# EAGLE design mic (EAGLE 6.5.0)
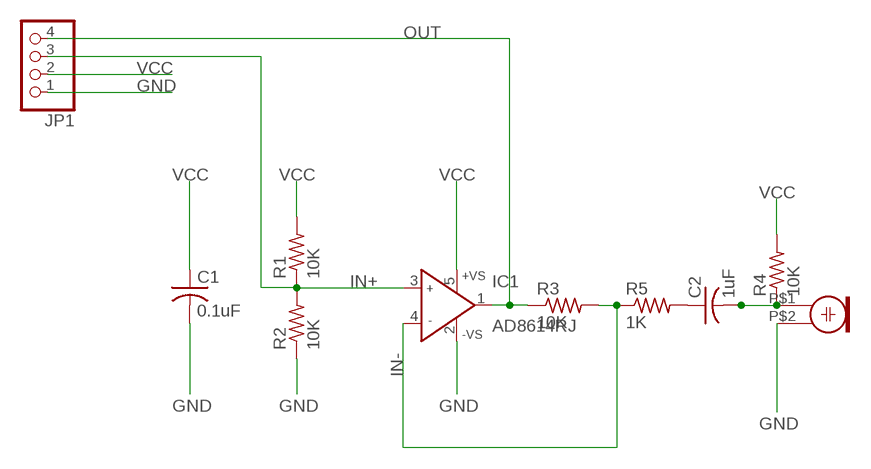
[diagram p0: schematic, sheet 1]

## Parts
C1  0.1uF  C-USC1206  [C1206]
C2  1uF  C-USC1206  [C1206]
IC1  AD8614RJ  [SOT23-5]
JP1  PINHD-1X4  [1X04]
R1  10K  R-US_R1206  [R1206]
R2  10K  R-US_R1206  [R1206]
R3  10K  R-US_R1206  [R1206]
R4  10K  R-US_R1206  [R1206]
R5  1K  R-US_R1206  [R1206]
U$1  ELECTRET  [ELECTRET_6MM_SMD]

## Nets
GND: C1.2 IC1.2(-VS) JP1.1 R2.1 U$1.P$2
IN+: IC1.3(IN+) JP1.3 R1.1 R2.2
IN-: IC1.4(IN-) R3.2 R5.1
N$3: C2.1 R5.2
N$4: C2.2 R4.1 U$1.P$1
OUT: IC1.1(OUT) JP1.4 R3.1
VCC: C1.1 IC1.5(+VS) JP1.2 R1.2 R4.2

## Library data of the parts
C1 C2 = rcl:C-US: CAPACITOR, American symbol
IC1 = analog-devices:AD8614: Single and Quad 18 V Operational Amplifiers Source: http://www.analog.com/static/imported-files/data_sheets/AD8614_8644.pdf; MF: ALTERA CORPORATION; MPN: AD8614ARTZ-REEL7; OC_FARNELL: 1464998; OC_NEWARK: 88H0303
JP1 = pinhead:PINHD-1X4: PIN HEADER
R1-R5 = rcl:R-US_: RESISTOR, American symbol
U$1 = LED Light:ELECTRET

## Board
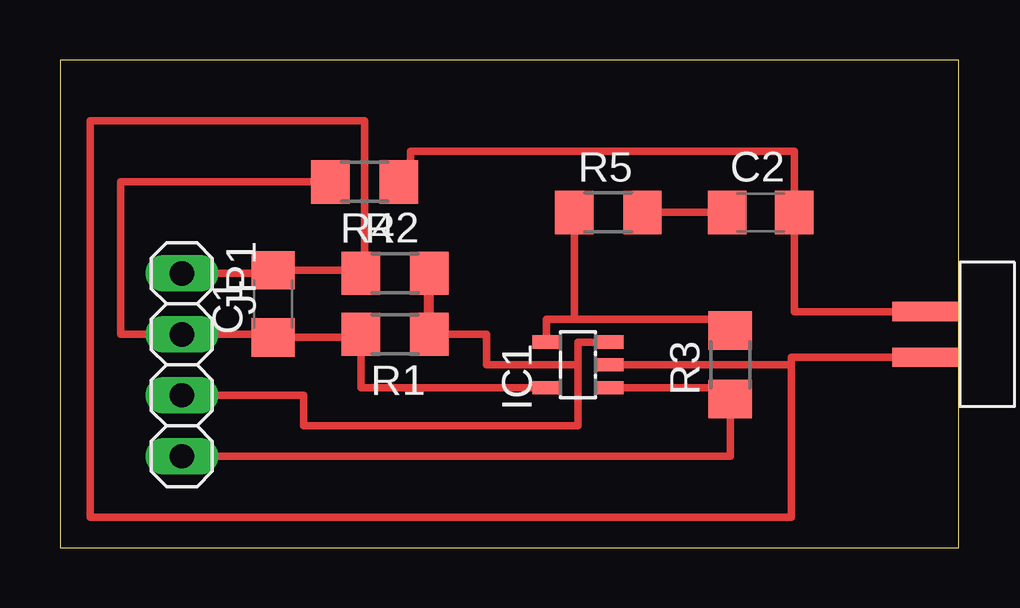
[diagram p1: board, top side]

Size 37.47 x 20.32 mm. Coordinates in mm from the lower left corner, seen from the top.
Outline: 0,0 37.47,0 37.47,20.32 0,20.32 0,0
Copper layers (1*16): Top 0.035mm / dielectric 1.5mm / Bottom 0.035mm
Design rules "default *": minimum track width 10mil, minimum drill 24mil, track to track 17mil, track to pad 17mil, pad to pad 17mil, via to via 17mil, smd to smd 8mil, copper to edge 40mil, drill to drill 8mil, minimum pad ring 10mil, minimum via ring 8mil, stop-mask expansion 4mil, vias tented up to drill 0mil, thermal gap 10mil

### Footprints (pad centres in the part's own frame; a part is rotated, then mirrored left to right if it is on the bottom)
C1206 = smd 1.6 x 1.8: 1 -1.4,0; 2 1.4,0
SOT23-5 = smd 0.55 x 1.2: 1 -0.95,-1.3; 2 0,-1.3; 3 0.95,-1.3; 4 0.95,1.3; 5 -0.95,1.3
1X04 = drill 1.016 long: 1 -3.81,0; 2 -1.27,0; 3 1.27,0; 4 3.81,0
R1206 = smd 1.6 x 1.803: 1 -1.422,0; 2 1.422,0
ELECTRET_6MM_SMD = smd 2.8 x 0.8: P$1 -2,0.95; P$2 -2,-0.95

### Placement (x,y rotation side)
C1  8.89,10.16 90 top
C2  29.21,13.97 0 top
IC1  21.59,7.62 90 top
JP1  5.08,7.62 270 top
R1  13.97,8.89 180 top
R2  13.97,11.43 0 top
R3  27.94,7.62 90 top
R4  12.7,15.24 180 top
R5  22.86,13.97 0 top
U$1  38.1,8.89 0 top

### Tracks (layer width: path | path; a pad name or v marks a point on that pad's centre or on a via)
GND
  Top 0.305: C1.2 12.55,11.56 | JP1.1 8.89,11.43 | 30.48,7.62 IC1.2 | 30.48,7.62 30.48,1.27 1.27,1.27 1.27,17.78 12.7,17.78 12.7,11.43 R2.1 | U$1.P$2 30.48,7.94 30.48,7.62
  Top 0.406: 12.55,11.56 R2.1 | 8.89,11.43 C1.2
IN+
  Top 0.305: R1.1 17.78,8.89 17.78,7.62 21.59,7.62 | 21.59,7.62 21.59,8.57 IC1.3 | JP1.3 10.16,6.35 10.16,5.08 21.59,5.08 21.59,7.62
  Top 0.406: R1.1 R2.2
IN-
  Top 0.305: IC1.4 20.29,9.53 21.44,9.53 | R3.2 27.94,9.53 21.59,9.53 21.44,9.53 | R5.1 21.44,9.53
N$3
  Top 0.305: R5.2 C2.1
N$4
  Top 0.305: R4.1 14.61,15.24 14.61,16.51 30.61,16.51 C2.2 30.61,10.16 30.61,9.84 U$1.P$1
OUT
  Top 0.305: IC1.1 27.94,6.67 | JP1.4 27.94,3.81 R3.1
  Top 0.406: 27.94,6.67 R3.1
VCC
  Top 0.305: 8.89,8.89 JP1.2 2.54,8.89 2.54,15.24 R4.2 | C1.1 12.55,8.76 R1.2 12.55,6.67 IC1.5
  Top 0.406: 8.89,8.89 C1.1